# EAGLE design Pour_Over_Board_Internal_Pullup (EAGLE 9.2.2)
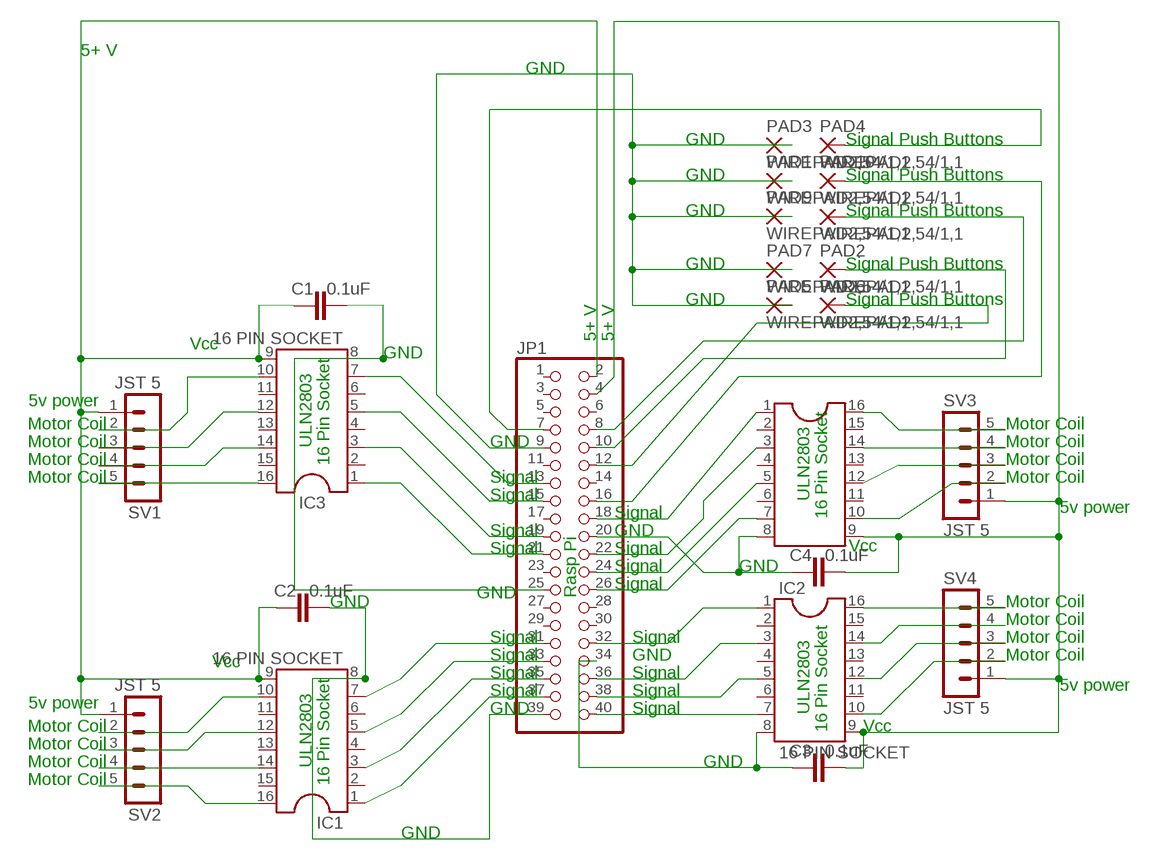
[diagram p0: schematic, sheet 1]

## Parts
C1  0.1uF  0.1UF-KIT-EZ-50V-20%  [CAP-PTH-SMALL-KIT]
C2  0.1uF  0.1UF-KIT-EZ-50V-20%  [CAP-PTH-SMALL-KIT]
C3  0.1uF  0.1UF-KIT-EZ-50V-20%  [CAP-PTH-SMALL-KIT]
C4  0.1uF  0.1UF-KIT-EZ-50V-20%  [CAP-PTH-SMALL-KIT]
IC1  16 PIN SOCKET  DIL16S  [SOCKET-16]
IC2  16 PIN SOCKET  DIL16S  [SOCKET-16]
IC3  16 PIN SOCKET  DIL16S  [SOCKET-16]
IC4  16 PIN SOCKET  DIL16S  [SOCKET-16]
JP1  RaspPiZero  PINHD-2X20  [2X20]
PAD1  WIREPAD2,54/1,1  [2,54/1,1]
PAD2  WIREPAD2,54/1,1  [2,54/1,1]
PAD3  WIREPAD2,54/1,1  [2,54/1,1]
PAD4  WIREPAD2,54/1,1  [2,54/1,1]
PAD5  WIREPAD2,54/1,1  [2,54/1,1]
PAD6  WIREPAD2,54/1,1  [2,54/1,1]
PAD7  WIREPAD2,54/1,1  [2,54/1,1]
PAD8  WIREPAD2,54/1,1  [2,54/1,1]
PAD9  WIREPAD2,54/1,1  [2,54/1,1]
PAD10  WIREPAD2,54/1,1  [2,54/1,1]
SV1  JST 5  MA05-1  [MA05-1]
SV2  JST 5  MA05-1  [MA05-1]
SV3  JST 5  MA05-1  [MA05-1]
SV4  JST 5  MA05-1  [MA05-1]

## Nets
N$1: IC3.7 JP1.13
N$2: C3.1 IC2.8 JP1.34
N$3: JP1.12 PAD6.1(P)
N$4: C1.1 C2.1 IC1.9 IC3.9 JP1.2 SV1.1 SV2.1
N$5: IC3.3 JP1.19
N$6: IC3.1 JP1.21
N$7: IC1.1 JP1.37
N$8: IC1.3 JP1.35
N$9: IC2.1 JP1.32
N$10: IC2.3 JP1.36
N$11: IC2.5 JP1.38
N$12: IC2.7 JP1.40
N$13: IC4.1 JP1.18
N$14: IC4.3 JP1.22
N$15: IC4.10 SV3.2
N$16: IC4.12 SV3.3
N$17: IC4.14 SV3.4
N$18: IC4.16 SV3.5
N$19: IC2.10 SV4.2
N$20: IC2.12 SV4.3
N$21: IC2.14 SV4.4
N$22: IC2.16 SV4.5
N$23: IC3.16 SV1.5
N$24: JP1.16 PAD10.1(P)
N$25: IC3.14 SV1.4
N$26: IC3.12 SV1.3
N$27: IC4.5 JP1.24
N$28: IC4.7 JP1.26
N$29: IC1.5 JP1.33
N$30: IC1.7 JP1.31
N$31: IC3.10 SV1.2
N$32: IC1.16 SV2.5
N$33: IC1.14 SV2.4
N$34: IC3.5 JP1.15
N$35: C2.2 IC1.8 JP1.39
N$36: IC1.12 SV2.3
N$37: IC1.10 SV2.2
N$38: C4.1 IC4.8 JP1.20
N$39: C1.2 IC3.8 JP1.25
N$40: C3.2 C4.2 IC2.9 IC4.9 JP1.4 SV3.1 SV4.1
N$41: JP1.8 PAD8.1(P)
N$43: JP1.9 PAD1.1(P) PAD3.1(P) PAD5.1(P) PAD7.1(P) PAD9.1(P)
N$44: JP1.10 PAD2.1(P)
N$47: JP1.7 PAD4.1(P)
Unconnected: IC1.2 IC1.4 IC1.6 IC1.11 IC1.13 IC1.15 IC2.2 IC2.4 IC2.6 IC2.11 IC2.13 IC2.15 IC3.2 IC3.4 IC3.6 IC3.11 IC3.13 IC3.15 IC4.2 IC4.4 IC4.6 IC4.11 IC4.13 IC4.15 JP1.1 JP1.3 JP1.5 JP1.6 JP1.11 JP1.14 JP1.17 JP1.23 JP1.27 JP1.28 JP1.29 JP1.30

## Notes on the sheet
- 5+ V
- GND
- GND | Signal | Push Buttons
- GND | Signal | Push Buttons
- GND | Signal | Push Buttons
- GND | Signal | Push Buttons
- GND | Signal | Push Buttons
- 5+ V | 5+ V
- Vcc
- GND
- 5v power
- Motor Coil | Motor Coil
- Motor Coil | ULN2803 | GND | Motor Coil
- Motor Coil | 16 Pin Socket | Motor Coil
- Motor Coil | Signal | Motor Coil
- Signal | ULN2803 | 5v power
- Signal | 16 Pin Socket
- Signal | GND
- Signal | Signal | Vcc
- Signal | GND
- Signal
- GND | Rasp Pi
- GND | Motor Coil
- Motor Coil
- Signal | Signal | Motor Coil
- Signal | GND | Motor Coil
- Vcc
- Signal | Signal | 5v power
- 5v power | Signal | Signal
- GND | Signal | ULN2803
- Motor Coil | 16 Pin Socket | Vcc
- Motor Coil
- Motor Coil | ULN2803 | GND
- Motor Coil | 16 Pin Socket
- GND

## Library data of the parts
C1-C4 = SparkFun-Capacitors:0.1UF: 0.1µF ceramic capacitors A capacitor is a passive two-terminal electrical component used to store electrical energy temporarily in an electric field.; PROD_ID: CAP-08370
IC1-IC4 = ic-package:DIL16: Dual In Line / Socket
JP1 = pinhead:PINHD-2X20: PIN HEADER
PAD1-PAD10 = wirepad:WIREPAD: Wire PAD connect wire on PCB
SV1-SV4 = con-lstb:MA05-1: PIN HEADER; OC_FARNELL: unknown; OC_NEWARK: unknown

## Net classes
0 default: clearance 0.205 mm

## Board
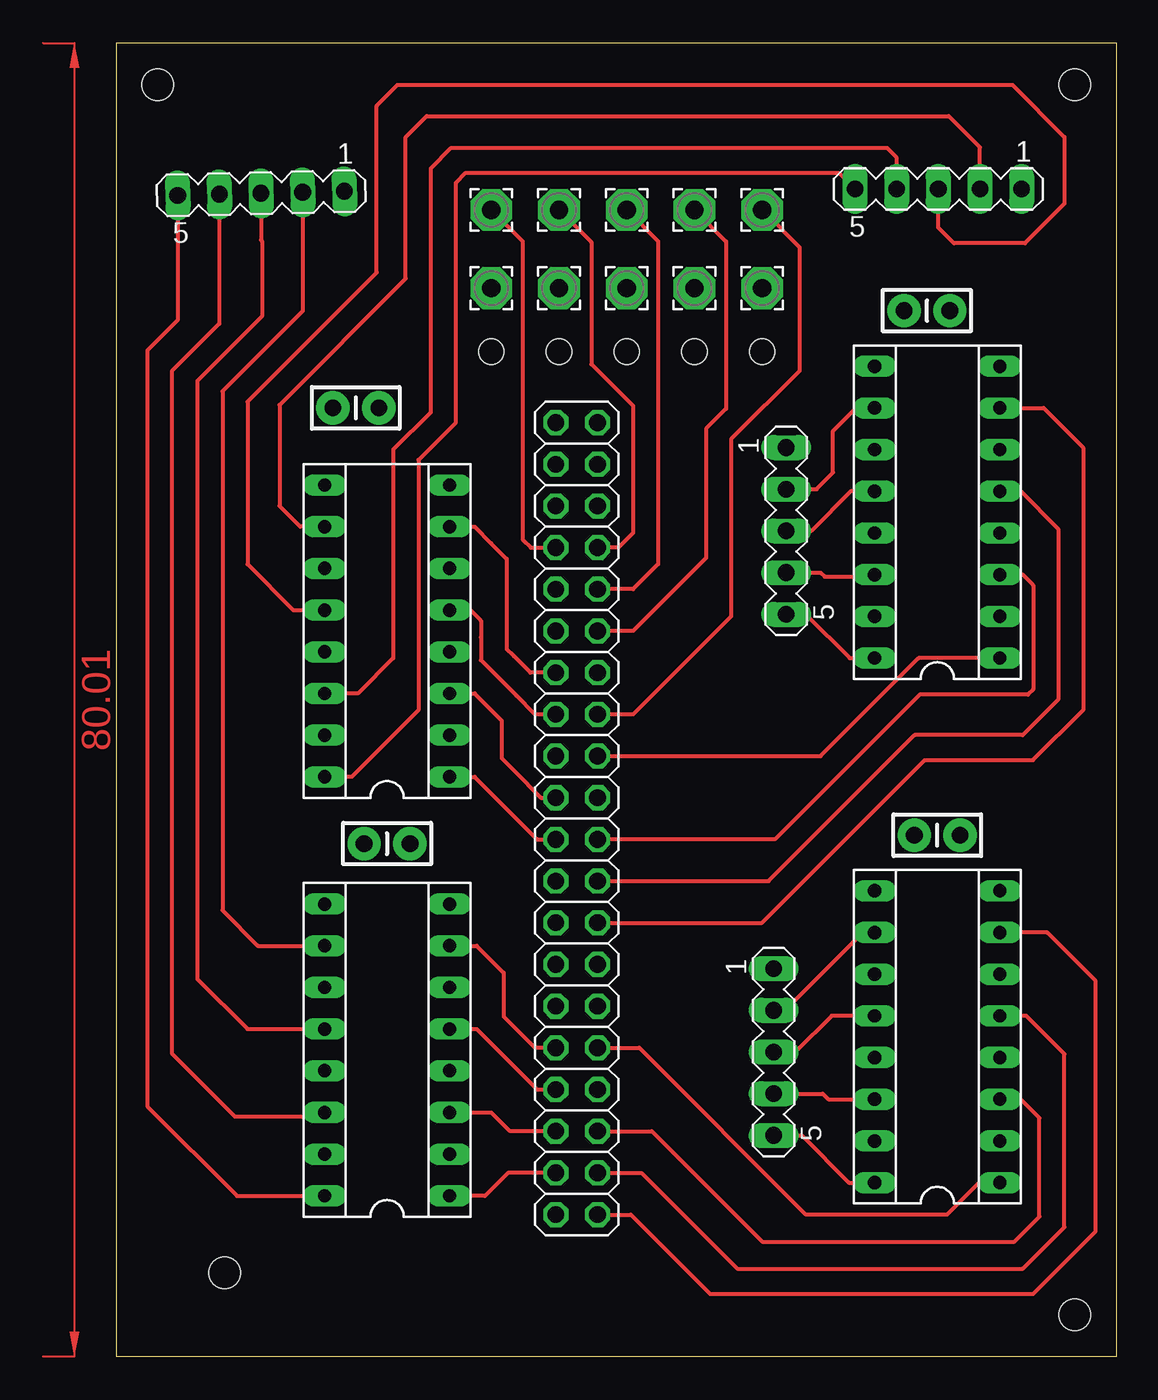
[diagram p1: board, top side]
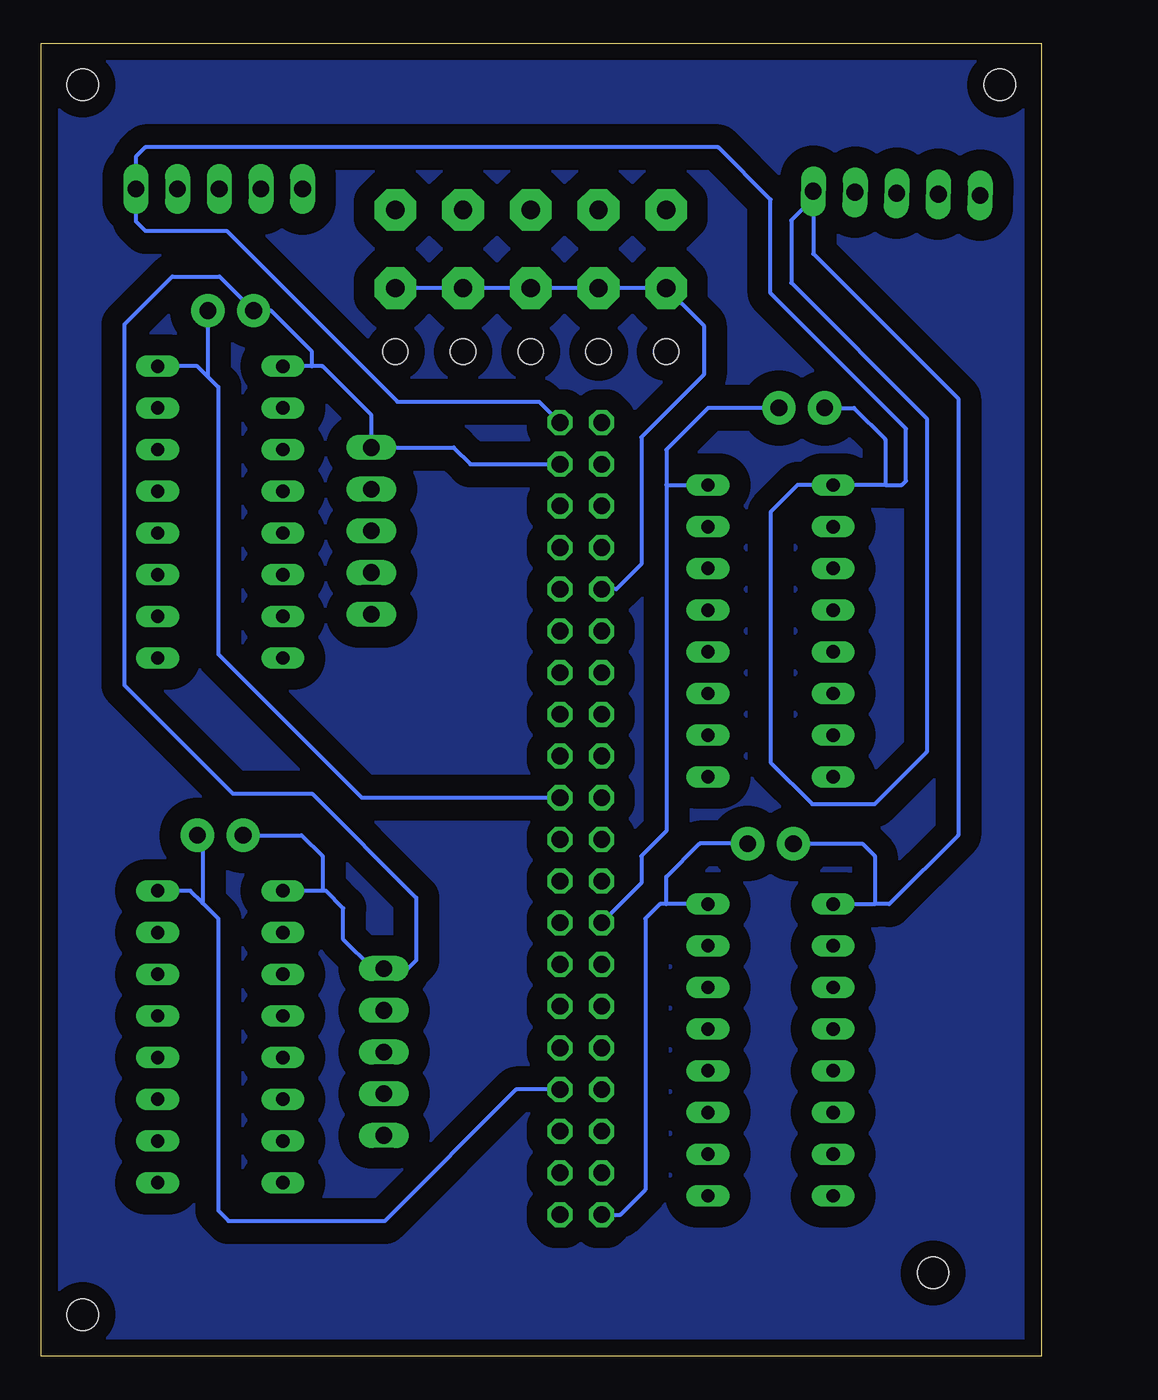
[diagram p2: board, bottom side, seen from below]

Size 60.96 x 80.01 mm. Coordinates in mm from the lower left corner, seen from the top.
Outline: 0,0 60.96,0 60.96,80.01 0,80.01 0,0
Copper layers (1*16): Top 0.035mm / dielectric 1.5mm / Bottom 0.035mm
Design rules "default *": minimum track width 10mil, minimum drill 0.35mm, track to track 50mil, track to pad 6mil, pad to pad 6mil, via to via 6mil, smd to smd 6mil, copper to edge 40mil, drill to drill 6mil, minimum pad ring 10mil, minimum via ring 8mil, stop-mask expansion 4mil, vias tented up to drill 0mil, thermal gap 8mil
Holes 1.91 mm at 2.54,77.47 58.42,77.47 6.6,5.08 58.42,2.54
Holes 1.52 mm at 22.86,61.21 26.99,61.21 31.11,61.21 35.24,61.21 39.37,61.21

### Footprints (pad centres in the part's own frame; a part is rotated, then mirrored left to right if it is on the bottom)
CAP-PTH-SMALL-KIT = drill 1.016 pad 2.032: 1 -1.397,0; 2 1.397,0
SOCKET-16 = drill 0.813 long: 1 -8.89,-3.81; 2 -6.35,-3.81; 3 -3.81,-3.81; 4 -1.27,-3.81; 5 1.27,-3.81; 6 3.81,-3.81; 7 6.35,-3.81; 8 8.89,-3.81; 9 8.89,3.81; 10 6.35,3.81; 11 3.81,3.81; 12 1.27,3.81; 13 -1.27,3.81; 14 -3.81,3.81; 15 -6.35,3.81; 16 -8.89,3.81
2X20 = drill 1.016 octagon: 1 -24.13,-1.27; 2 -24.13,1.27; 3 -21.59,-1.27; 4 -21.59,1.27; 5 -19.05,-1.27; 6 -19.05,1.27; 7 -16.51,-1.27; 8 -16.51,1.27; 9 -13.97,-1.27; 10 -13.97,1.27; 11 -11.43,-1.27; 12 -11.43,1.27; 13 -8.89,-1.27; 14 -8.89,1.27; 15 -6.35,-1.27; 16 -6.35,1.27; 17 -3.81,-1.27; 18 -3.81,1.27; 19 -1.27,-1.27; 20 -1.27,1.27; 21 1.27,-1.27; 22 1.27,1.27; 23 3.81,-1.27; 24 3.81,1.27; 25 6.35,-1.27; 26 6.35,1.27; 27 8.89,-1.27; 28 8.89,1.27; 29 11.43,-1.27; 30 11.43,1.27; 31 13.97,-1.27; 32 13.97,1.27; 33 16.51,-1.27; 34 16.51,1.27; 35 19.05,-1.27; 36 19.05,1.27; 37 21.59,-1.27; 38 21.59,1.27; 39 24.13,-1.27; 40 24.13,1.27
2,54/1,1 = drill 1.118 pad 2.54 octagon: 1 0,0
MA05-1 = drill 1.016 long: 1 -5.08,0; 2 -2.54,0; 3 0,0; 4 2.54,0; 5 5.08,0

### Placement (x,y rotation side)
C1  14.6,57.79 0 top
C2  16.51,31.24 0 top
C3  50.04,31.75 180 top
C4  49.4,63.71 180 top
IC1  16.51,18.67 90 top
IC2  50.04,19.47 90 top
IC3  16.51,44.2 90 top
IC4  50.04,51.43 90 top
JP1  28.07,32.77 270 top
PAD1  31.11,65.09 0 top
PAD2  31.11,69.85 0 top
PAD3  22.86,65.09 0 top
PAD4  22.86,69.85 0 top
PAD5  35.24,65.09 0 top
PAD6  35.24,69.85 0 top
PAD7  26.99,65.09 0 top
PAD8  26.99,69.85 0 top
PAD9  39.37,65.09 90 top
PAD10  39.37,69.85 0 top
SV1  50.1,71.12 180 top
SV2  8.83,70.87 181.4 top
SV3  40.83,50.29 270 top
SV4  40.07,18.54 270 top

### Tracks (layer width: path | path; a pad name or v marks a point on that pad's centre or on a via)
N$1
  Top 0.254: IC3.7 21.84,50.55 22.86,49.53 23.8,48.59 23.8,43.11 24.25,42.66 25.25,41.66 JP1.13
N$2
  Bottom 0.254: 51.12,27.62 51.86,28.36 IC2.8 | 51.12,27.62 50.16,26.67 50.16,8.89 49.53,8.25 40,8.25 32,16.26 JP1.34 | C3.1 51.12,31.43 51.12,27.62
N$3
  Top 0.254: JP1.12 31.5,44.2 35.94,48.64 35.94,56.51 37.16,57.73 37.16,67.93 PAD6.1
N$4
  Bottom 0.254: 10.16,27.56 9.27,27.56 5.08,31.75 5.08,58.36 13.9,67.18 SV2.1 13.9,70.55 15.24,69.21 15.24,65.4 6.98,57.15 6.98,36.83 10.16,33.66 13.97,33.66 16.51,36.2 16.51,51.44 14.86,53.09 IC3.9 9.53,53.09 | 9.53,53.09 9.53,55.88 11.43,57.79 C1.1 | IC1.9 10.16,27.56 | C2.1 10.92,31.24 10.16,30.48 10.16,27.56 | 9.53,53.09 8.51,53.09 8.25,53.34 8.25,56.52 16.51,64.77 16.51,70.48 19.69,73.66 54.61,73.66 55.18,73.09 SV1.1 55.18,69.15 54.61,68.58 49.66,68.58 39.25,58.17 30.61,58.17 JP1.2
N$5
  Top 0.254: IC3.3 21.84,40.39 23.5,38.73 23.5,36.45 24.26,35.69 25.9,34.04 JP1.19
N$6
  Top 0.254: IC3.1 21.84,35.31 23.5,33.66 25.65,31.5 JP1.21
N$7
  Top 0.254: JP1.37 23.88,11.18 22.48,9.78 IC1.1
N$8
  Top 0.254: JP1.35 24,13.72 22.86,14.86 IC1.3
N$9
  Top 0.254: IC2.1 52.58,10.58 50.63,8.64 42.04,8.64 31.88,18.8 JP1.32
N$10
  Top 0.254: JP1.36 32.64,13.72 39.37,6.99 54.74,6.99 56.26,8.5 56.26,14.52 55.12,15.66 IC2.3
N$11
  Top 0.254: JP1.38 32,11.18 37.85,5.33 55.24,5.33 57.78,7.87 57.78,18.41 55.46,20.74 IC2.5
N$12
  Top 0.254: JP1.40 31.37,8.64 36.2,3.81 55.88,3.81 59.69,7.62 59.69,22.86 56.73,25.82 IC2.7
N$13
  Top 0.254: IC4.1 48.89,42.55 42.93,36.58 JP1.18
N$14
  Top 0.254: JP1.22 40.14,31.5 48.96,40.32 55.56,40.32 55.88,40.64 55.88,46.99 55.24,47.62 IC4.3
N$15
  Top 0.254: SV3.2 42.67,52.83 43.69,53.85 43.69,56.39 45.09,57.79 IC4.10
N$16
  Top 0.254: IC4.12 44.77,52.7 42.35,50.29 SV3.3
N$17
  Top 0.254: SV3.4 42.93,47.75 43.18,47.5 46.1,47.5 IC4.14
N$18
  Top 0.254: SV3.5 42.04,45.21 44.7,42.55 IC4.16
N$19
  Top 0.254: SV4.2 40.77,21.08 45.51,25.82 IC2.10
N$20
  Top 0.254: IC2.12 43.6,20.74 41.4,18.54 SV4.3
N$21
  Top 0.254: SV4.4 43.05,16 43.39,15.66 IC2.14
N$22
  Top 0.254: SV4.5 41.78,13.46 44.66,10.58 IC2.16
N$23
  Top 0.254: IC3.16 14.35,35.31 18.42,39.37 18.42,54.61 20.7,56.9 20.7,71.5 21.3,72.1 44.04,72.1 SV1.5
N$24
  Top 0.254: JP1.16 31.5,39.12 37.46,45.09 37.46,55.88 41.66,60.07 41.66,67.56 PAD10.1
N$25
  Top 0.254: SV1.4 47.56,73.02 46.96,73.63 20.42,73.63 19.18,72.39 19.18,57.53 16.89,55.24 16.89,42.55 14.73,40.39 IC3.14
N$26
  Top 0.254: IC3.12 10.79,45.47 8,48.26 8,58.17 15.87,66.04 15.87,76.2 17.15,77.47 54.61,77.47 57.78,74.29 57.78,70.23 55.37,67.82 51.05,67.82 50.1,68.77 SV1.3
N$27
  Top 0.254: IC4.5 55.12,52.7 57.4,50.42 57.4,40.01 55.24,37.85 48.64,37.85 39.75,28.96 JP1.24
N$28
  Top 0.254: JP1.26 39.37,26.42 49.27,36.32 55.87,36.32 58.93,39.38 58.93,55.37 56.52,57.79 IC4.7
N$29
  Top 0.254: IC1.5 21.97,19.94 25.65,16.26 JP1.33
N$30
  Top 0.254: JP1.31 25.53,18.8 23.62,20.7 23.62,23.37 21.97,25.02 IC1.7
N$31
  Top 0.254: SV1.2 52.64,73.66 50.74,75.56 18.93,75.56 17.65,74.29 17.65,65.66 9.96,57.97 9.96,51.82 11.22,50.55 IC3.10
N$32
  Top 0.254: SV2.5 3.75,63.12 1.9,61.28 1.9,15.24 7.37,9.78 IC1.16
N$33
  Top 0.254: IC1.14 12.45,14.61 7.24,14.61 3.43,18.41 3.43,60.06 6.29,62.92 SV2.4
N$34
  Top 0.254: IC3.5 21.59,45.47 22.23,44.83 22.23,43.81 22.23,42.42 24.38,40.26 25.53,39.12 JP1.15
N$35
  Bottom 0.254: C2.2 20.83,31.24 22.86,29.21 22.86,27.56 | IC1.8 22.86,27.56 | 22.86,27.56 23.24,27.56 24.13,26.67 24.13,10.16 25.65,8.64 JP1.39
N$36
  Top 0.254: SV2.3 8.83,68.01 8.89,67.94 8.89,63.37 4.95,59.43 4.95,22.99 8,19.94 IC1.12
N$37
  Top 0.254: IC1.10 8.64,25.02 6.48,27.18 6.48,58.8 11.37,63.69 SV2.2
N$38
  Bottom 0.254: 50.8,59.69 51.43,60.33 IC4.8 | 50.8,59.69 50.16,59.05 50.16,42.8 41.41,34.04 JP1.20 | C4.1 50.8,59.69
N$39
  Bottom 0.254: 22.86,53.09 IC3.8 | C1.2 20.32,57.79 22.86,55.24 22.86,53.09 | 22.86,53.09 22.86,32 24.38,30.48 24.38,28.83 JP1.25
N$40
  Bottom 0.254: 43.81,28.36 43.6,28.36 42.54,27.3 42.54,25.4 40.77,23.62 SV4.1 38.61,23.62 38.1,24.13 38.1,27.94 44.45,34.29 49.28,34.29 55.88,40.89 55.88,62.87 52.96,65.79 50.08,65.79 C4.2 46.95,63.71 44.45,61.21 44.45,60.33 | 43.81,28.36 IC2.9 | 43.81,28.36 43.81,30.48 45.09,31.75 C3.2 | 44.45,60.33 43.81,60.33 40.83,57.34 SV3.1 35.81,55.37 34.8,54.36 JP1.4 | 44.45,60.33 IC4.9
N$41
  Top 0.254: JP1.8 30.61,49.28 31.5,50.16 31.5,57.91 28.96,60.45 28.96,67.88 PAD8.1
N$43
  Bottom 0.254: JP1.9 25.91,46.74 24.38,48.26 24.38,56.01 20.57,59.82 20.57,62.8 PAD3.1 PAD7.1 PAD1.1 PAD5.1 PAD9.1
N$44
  Top 0.254: PAD2.1 33.02,67.94 33.02,48.26 31.5,46.74 JP1.10
N$47
  Top 0.254: PAD4.1 24.77,67.94 24.77,49.78 25.27,49.28 JP1.7
UUU
  pour Bottom (isolate 0.533, rank 6): 0,80.01 60.96,80.01 60.96,0 0,0
(copper drawn outside any net)
  shapes: Top area x2